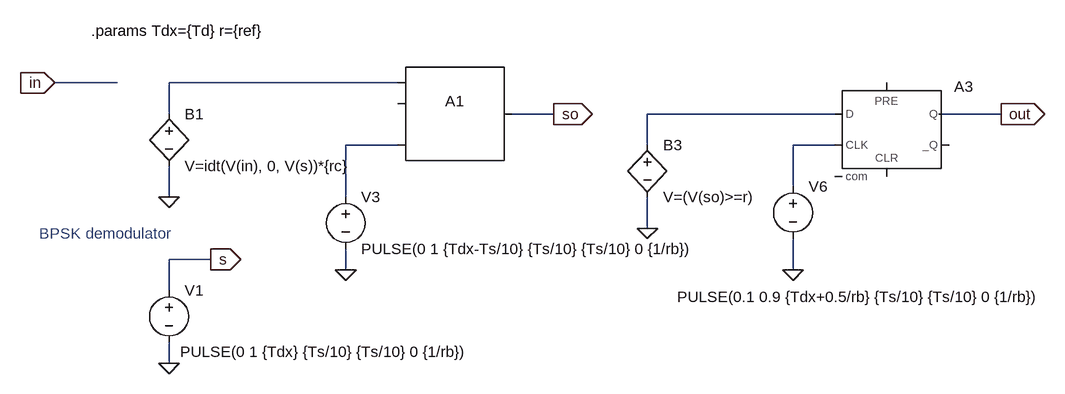
[diagram p0: schematic bpsk_demod.asc]
bpsk_demod.asc, the LTspice schematic file:
Version 4
SHEET 1 1944 996
WIRE 64 16 -32 16
WIRE 144 64 144 16
WIRE 144 192 144 144
WIRE 144 336 144 288
WIRE 144 448 144 416
WIRE 208 288 144 288
WIRE 416 192 416 112
WIRE 416 304 416 272
WIRE 496 16 144 16
WIRE 496 112 416 112
WIRE 736 64 672 64
WIRE 880 112 880 64
WIRE 880 240 880 192
WIRE 1104 176 1104 112
WIRE 1104 304 1104 256
WIRE 1168 64 880 64
WIRE 1168 112 1104 112
WIRE 1424 64 1328 64
FLAG -32 16 in
IOPIN -32 16 In
FLAG 144 192 0
FLAG 144 448 0
FLAG 208 288 s
IOPIN 208 288 Out
FLAG 880 240 0
FLAG 736 64 so
IOPIN 736 64 Out
FLAG 416 304 0
FLAG 1424 64 out
IOPIN 1424 64 Out
FLAG 1104 304 0
SYMBOL bv 144 48 R0
SYMATTR InstName B1
SYMATTR Value V=idt(V(in), 0, V(s))*{rc}
SYMBOL voltage 144 320 R0
WINDOW 123 0 0 Left 0
WINDOW 39 0 0 Left 0
WINDOW 3 17 110 Left 0
SYMATTR Value PULSE(0 1 {Tdx} {Ts/10} {Ts/10} 0 {1/rb})
SYMATTR InstName V1
SYMBOL bv 880 96 R0
SYMATTR InstName B3
SYMATTR Value V=(V(so)>=r)
SYMBOL SpecialFunctions\\sample 576 48 R0
SYMATTR InstName A1
SYMBOL voltage 416 176 R0
WINDOW 123 0 0 Left 0
WINDOW 39 0 0 Left 0
SYMATTR InstName V3
SYMATTR Value PULSE(0 1 {Tdx-Ts/10} {Ts/10} {Ts/10} 0 {1/rb})
SYMBOL Digital\\dflop 1248 16 R0
SYMATTR InstName A3
SYMBOL voltage 1104 160 R0
WINDOW 3 -178 186 Left 0
WINDOW 123 0 0 Left 0
WINDOW 39 0 0 Left 0
SYMATTR Value PULSE(0.1 0.9 {Tdx+0.5/rb} {Ts/10} {Ts/10} 0 {1/rb})
SYMATTR InstName V6
TEXT -56 248 Left 0 ;BPSK demodulator
TEXT 24 -64 Left 0 !.params Tdx={Td} r={ref}

The netlist it stands for:
* bpsk_demod.asc
B1 N001 0 V=idt(V(in), 0, V(s))*{rc}
V1 s 0 PULSE(0 1 {Tdx} {Ts/10} {Ts/10} 0 {1/rb})
B3 N003 0 V=(V(so)>=r)
A1 N001 0 0 N002 0 0 so 0 SAMPLEHOLD
V3 N002 0 PULSE(0 1 {Tdx-Ts/10} {Ts/10} {Ts/10} 0 {1/rb})
A3 N003 0 N004 0 0 0 out 0 DFLOP
V6 N004 0 PULSE(0.1 0.9 {Tdx+0.5/rb} {Ts/10} {Ts/10} 0 {1/rb})
* BPSK demodulator
.params Tdx={Td} r={ref}
.backanno
.end